# Altium schematic sheet sensors.schdoc
size 264 x 115 mm
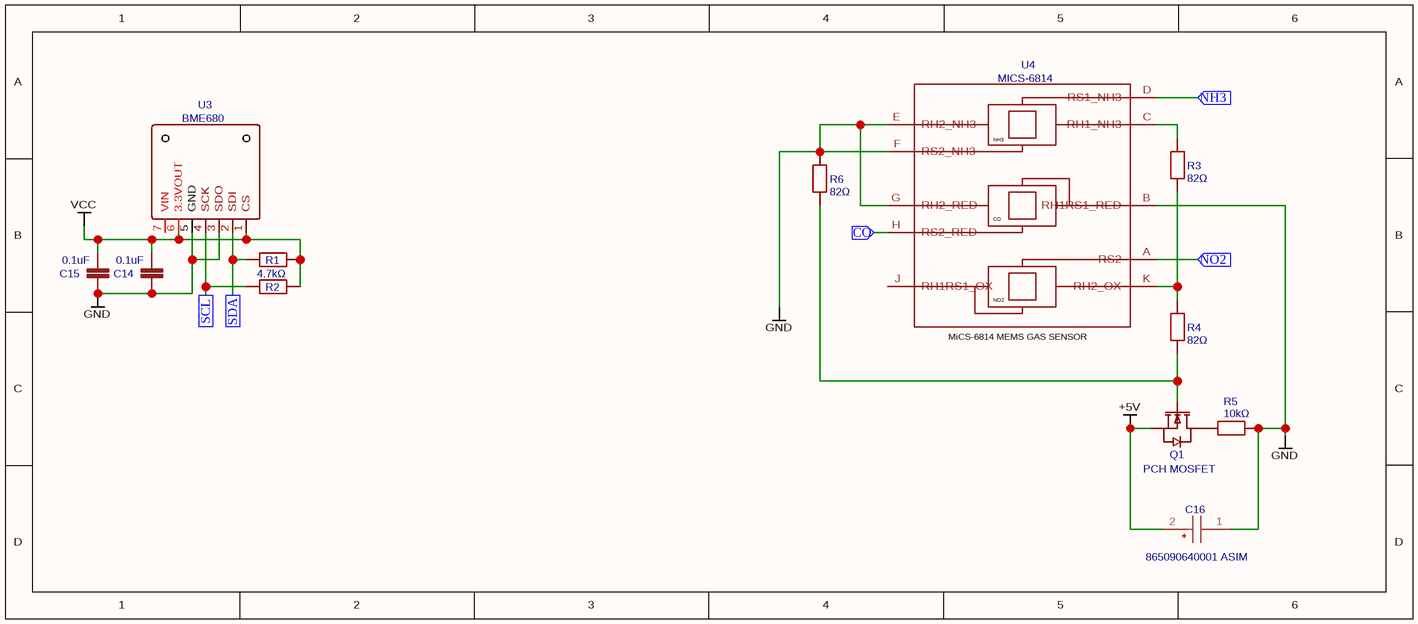
[diagram p0: sensors.schdoc]

## Parts
C14  0.1uF  [0603-CAP]
C15  0.1uF  [0603-CAP]
C16  865090640001 ASIM  [CAPAE430X550N MOD]
Q1  PCH MOSFET  [PG-SOT23-3_L2.9-W1.3-P1.90-LS2.4-BR]
R1  4.7kΩ  [R0603]
R2  4.7kΩ  [R0603]  (value not drawn)
R3  82Ω  [R0603]
R4  82Ω  [R0603]
R5  10kΩ  [R0603]
R6  82Ω  [R0603]
U3  BME680  [LGA-8-3X3MM]
U4  MICS-6814  [SNR10-SMD-1.25-7.5X5.5MM]

## Ports
CO (in), NH3 (in), NO2 (in), SCL (in), SDA (in)

## Nets
+5V: C16.2(-) Q1.2(S)
GND: C14.2 C15.2 C16.1(+) R5.1 R6.1 U3.3(SDO) U3.5(GND) U4.B(RH1RS1_RED) U4.E(RH2_NH3) U4.F(RS2_NH3) U4.G(RH2_RED)
VCC: C14.1 C15.1 R1.1 R2.1 U3.1(CS) U3.6(3.3VOUT)
CO: U4.H(RS2_RED) ; port CO
NH3: U4.D(RS1_NH3) ; port NH3
NO2: U4.A(RS2) ; port NO2
SCL: R2.2 U3.4(SCK) ; port SCL
SDA: R1.2 U3.2(SDI) ; port SDA
NetQ1_1: Q1.1(G) R4.1 R6.2
NetQ1_3: Q1.3(D) R5.2
NetR3_1: R3.1 R4.2 U4.K(RH2_OX)
NetR3_2: R3.2 U4.C(RH1_NH3)

Not connected (* = marked no-connect by the designer): U3 7(VIN); U4 J(RH1RS1_OX)

## Notes on the sheet
- (in symbol MICS-6814) NH3; CO; NO2; MiCS-6814 MEMS GAS SENSOR

## Library data of the parts
C14 C15 = 0.1uF: description: CAP-00810; Contributor: SparkFun; spicePre: C; spiceSymbolName: 0.1UF-25V(+80_-20%)(0603)
C16 = 865090640001 ASIM: Contributor: Rajesh Kumar; Supplier: Element14; spicePre: C; spiceSymbolName: 865090640001 ASIM
Q1 = PCH MOSFET: BOM_Manufacturer: VBsemi Elec; BOM_Manufacturer Part: VB1240B; Contributor: LCSC; BOM_Supplier: LCSC; BOM_Supplier Part: C516873; BOM_JLCPCB Part Class: Extended Part; spicePre: Q; spiceSymbolName: VB1240B
R1 R2 = 4.7kΩ: BOM_Manufacturer: UNI-ROYAL(Uniroyal Elec); BOM_Manufacturer Part: TC0350D4701T5H; nameAlias: Resistance; Contributor: LCSC; BOM_Supplier: LCSC; BOM_Supplier Part: C517493; Resistance (Ohms): 4.7kΩ; BOM_JLCPCB Part Class: Extended Part; spicePre: R; spiceSymbolName: TC0350D4701T5H
R3 R4 R6 = 82Ω: BOM_Manufacturer: Resistor.Today; BOM_Manufacturer Part: TCTR0603F47K0F3960T; Contributor: LCSC; BOM_Supplier: LCSC; BOM_Supplier Part: C525388; BOM_JLCPCB Part Class: Extended Part; spicePre: R; spiceSymbolName: TCTR0603F47K0F3960T
R5 = 10kΩ: BOM_Manufacturer: Resistor.Today; BOM_Manufacturer Part: TCTR0603F47K0F3960T; Contributor: LCSC; BOM_Supplier: LCSC; BOM_Supplier Part: C525388; BOM_JLCPCB Part Class: Extended Part; spicePre: R; spiceSymbolName: TCTR0603F47K0F3960T
U3 = BME680: BOM_Manufacturer: Bosch Sensortec; Contributor: mecopela; BOM_Supplier: LCSC; BOM_Supplier Part: C125972; BOM_Manufacturer Part: BME680; spicePre: U; spiceSymbolName: BME680_ADAFRUIT
U4 = MICS-6814: description: 314100015; Contributor: sozturk; spicePre: U; spiceSymbolName: SENSOR-MICS-6814